# EAGLE design LCD-IDC Adapter (EAGLE 7.5.0)
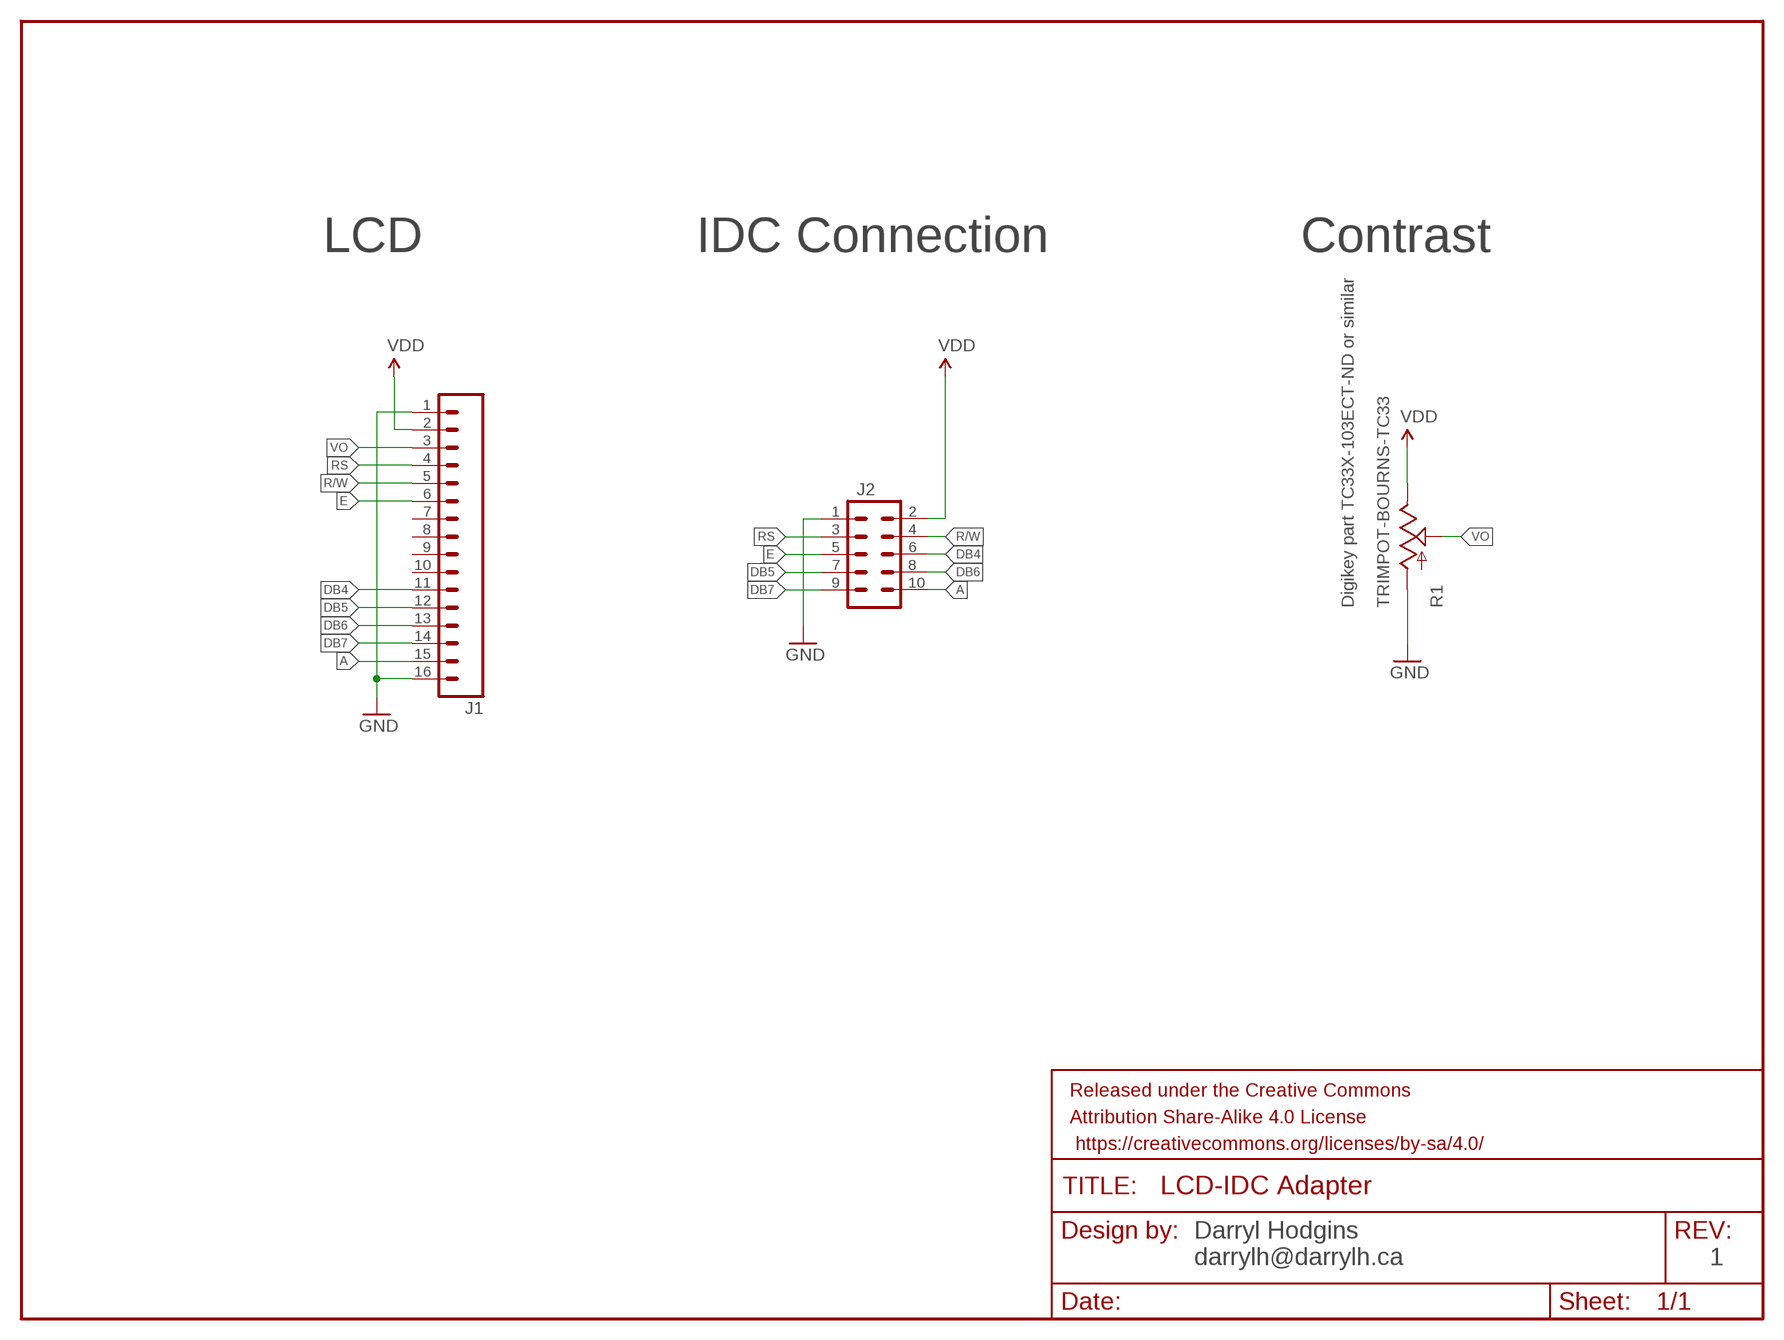
[diagram p0: schematic, sheet 1]

## Parts
FRAME1  FRAME-LETTER  [CREATIVE_COMMONS]
J1  M16PTH  [1X16]
J2  M05X2SHD  [2X5-SHROUDED]
R1  TRIMPOT-BOURNS-TC33  [TRIMPOT-BOURNS-TC33]

## Nets
A: J1.15 J2.10
DB4: J1.11 J2.6
DB5: J1.12 J2.7
DB6: J1.13 J2.8
DB7: J1.14 J2.9
E: J1.6 J2.5
GND: J1.1 J1.16 J2.1 R1.1(A)
R/W: J1.5 J2.4
RS: J1.4 J2.3
VDD: J1.2 J2.2 R1.3(E)
VO: J1.3 R1.2(S)
Unconnected: J1.7 J1.8 J1.9 J1.10

## Notes on the sheet
- LCD | IDC Connection | Contrast
- Digikey part TC33X-103ECT-ND or similar
- Darryl Hodgins
  darrylh@darrylh.ca
- 1

## Library data of the parts
FRAME1 = SparkFun-Aesthetics:FRAME-LETTER: Schematic Frame Standard 8.5x11 US Letter frame
J1 = SparkFun-Connectors:M16: 1x16 .1" header
J2 = SparkFun-Connectors:M05X2: Header 5x2 Standard 10-pin dual row 0.1" header. Commonly used with AVR-ISP. Use with Spark Fun Electronics SKU: PRT-00778
R1 = Darryl-Electromechanical:TRIMPOT

## Board
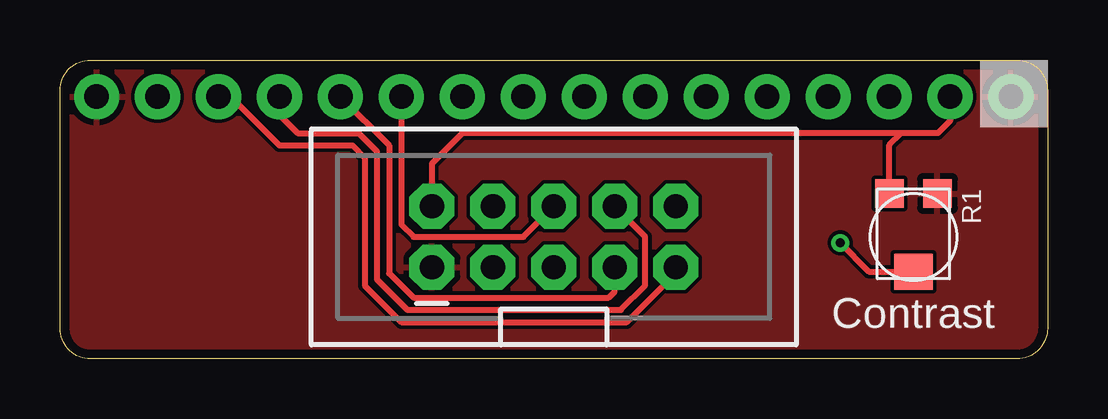
[diagram p1: board, top side]
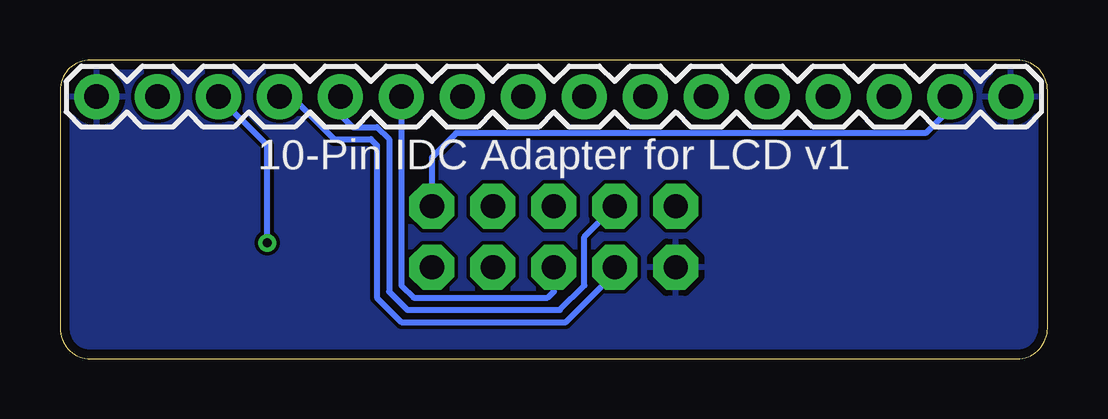
[diagram p2: board, bottom side, seen from below]

Size 41.15 x 12.45 mm. Coordinates in mm from the lower left corner, seen from the top.
Outline: 41.15,11.18 41.15,1.27 arc-90 39.88,0 1.27,0 arc-90 0,1.27 0,11.18 arc-90 1.27,12.45 39.88,12.45 arc-90 41.15,11.18
Copper layers (1*16): Top 0.0356mm / dielectric 1.5011mm / Bottom 0.0356mm
Design rules "oshpark-2layer *": minimum track width 6mil, minimum drill 13mil, track to track 6mil, track to pad 6mil, pad to pad 6mil, via to via 6mil, smd to smd 6mil, copper to edge 15mil, drill to drill 6mil, minimum pad ring 7mil, minimum via ring 7mil, stop-mask expansion 4mil, vias tented up to drill 20mil, thermal gap 10mil

### Footprints (pad centres in the part's own frame; a part is rotated, then mirrored left to right if it is on the bottom)
1X16 = drill 1.016 pad 1.88: 1 0,0; 2 2.54,0; 3 5.08,0; 4 7.62,0; 5 10.16,0; 6 12.7,0; 7 15.24,0; 8 17.78,0; 9 20.32,0; 10 22.86,0; 11 25.4,0; 12 27.94,0; 13 30.48,0; 14 33.02,0; 15 35.56,0; 16 38.1,0
2X5-SHROUDED = drill 1.016 pad 1.88 octagon: 1 -1.27,5.08; 2 1.27,5.08; 3 -1.27,2.54; 4 1.27,2.54; 5 -1.27,0; 6 1.27,0; 7 -1.27,-2.54; 8 1.27,-2.54; 9 -1.27,-5.08; 10 1.27,-5.08
TRIMPOT-BOURNS-TC33 = smd 1.2 x 1.2: 1 -1,-1.8; 3 1,-1.8 | smd 1.6 x 1.5: 2 0,1.45

### Placement (x,y rotation side)
FRAME1  20.83,-7.62 0 top  (outside the outline)
J1  39.62,10.92 0 bottom
J2  20.57,5.08 90 top
R1  35.56,5.08 180 top

### Tracks (layer width: path | path; a pad name or v marks a point on that pad's centre or on a via)
A
  Bottom 0.254: J1.15 4.06,10.41 5.08,9.4 24.64,9.4 25.65,8.38 J2.10
DB4
  Top 0.254: J1.11 14.22,5.59 14.73,5.08 19.3,5.08 J2.6
DB5
  Top 0.254: J1.12 13.72,8.89 13.72,3.56 14.73,2.54 22.86,2.54 23.11,2.79 J2.7
DB6
  Top 0.254: J1.13 9.14,10.16 9.91,9.4 12.45,9.4 13.21,8.64 13.21,3.3 14.48,2.03 23.37,2.03 24.38,3.05 24.38,5.08 J2.8
DB7
  Top 0.254: J1.14 7.11,10.92 9.14,8.89 12.19,8.89 12.7,8.38 12.7,3.05 14.22,1.52 23.62,1.52 25.65,3.56 J2.9
E
  Bottom 0.254: J1.6 26.92,3.05 26.42,2.54 20.83,2.54 20.57,2.79 J2.5
GND
  pour Top: 0,12.45 41.15,12.45 41.15,0 0,0
  pour Bottom: 0,12.45 41.15,12.45 41.15,0 0,0
R/W
  Bottom 0.254: J1.5 29.46,10.16 28.96,9.65 27.94,9.65 27.43,9.14 27.43,2.79 26.67,2.03 20.32,2.03 19.3,3.05 19.3,5.08 J2.4
RS
  Bottom 0.254: J1.4 31.5,10.92 29.72,9.14 28.19,9.14 27.94,8.89 27.94,2.54 26.92,1.52 20.07,1.52 18.03,3.56 J2.3
VDD
  Top 0.254: J1.2 37.08,9.91 36.58,9.4 35.05,9.4 | 35.05,9.4 16.76,9.4 15.49,8.13 J2.2 | R1.3 34.56,8.91 35.05,9.4
VO  (via drill 0.38)
  Top 0.254: v32.51,4.83 33.71,3.63 R1.2
  Bottom 0.254: v32.51,4.83 32.51,8.89 J1.3

### Text on the board
tNames: Contrast
bNames: 10-Pin IDC Adapter for LCD v1
Document: Darryl Hodgins